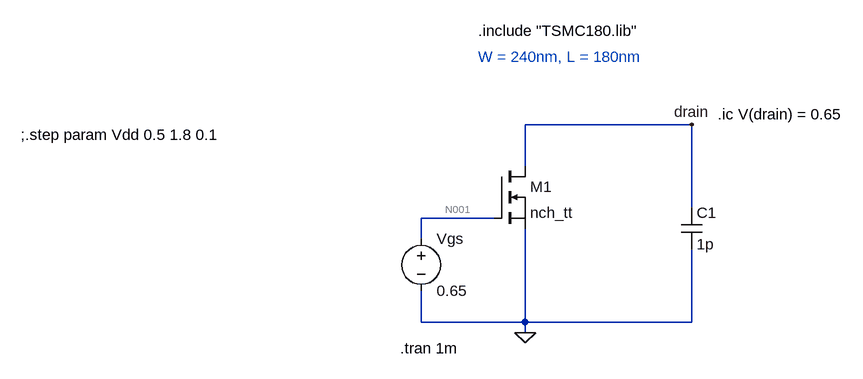
[diagram p0: schematic Q1_nmos_240_180.asc]
Q1_nmos_240_180.asc, the LTspice schematic file:
Version 4
SHEET 1 1284 680
WIRE 400 192 144 192
WIRE 144 256 144 192
WIRE 400 320 400 192
WIRE 96 336 -16 336
WIRE -16 368 -16 336
WIRE -16 496 -16 448
WIRE 144 496 144 352
WIRE 144 496 -16 496
WIRE 400 496 400 384
WIRE 400 496 144 496
WIRE 144 512 144 496
FLAG 144 512 0
FLAG 400 192 drain
SYMBOL nmos 96 256 R0
SYMATTR InstName M1
SYMATTR Value nch_tt
SYMATTR Value2 W=240n L=180n
SYMBOL voltage -16 352 R0
WINDOW 123 0 0 Left 0
WINDOW 39 0 0 Left 0
SYMATTR InstName Vgs
SYMATTR Value 0.65
SYMBOL cap 384 320 R0
SYMATTR InstName C1
SYMATTR Value 1p
TEXT 72 48 Left 2 !.include "TSMC180.lib"
TEXT 72 88 Left 2 ;W = 240nm, L = 180nm
TEXT 440 176 Left 2 !.ic V(drain) = 0.65
TEXT -48 536 Left 2 !.tran 1m
TEXT -632 208 Left 2 !;.step param Vdd 0.5 1.8 0.1

The netlist it stands for:
* Q1_nmos_240_180.asc
M1 drain N001 0 0 nch_tt W=240n L=180n
Vgs N001 0 0.65
C1 drain 0 1p
.model NMOS NMOS
.model PMOS PMOS
.lib standard.mos
.include "TSMC180.lib"
* W = 240nm, L = 180nm
.ic V(drain) = 0.65
.tran 1m
;.step param Vdd 0.5 1.8 0.1
.backanno
.end

* Results of the author's LTspice run, read from the files saved beside the schematic
* Operating Point, zero values left out:
*   V(drain) = 650 mV
*   V(n001) = 650 mV
*   Id(M1) = 10.07 µA
*   Is(M1) = -10.07 µA
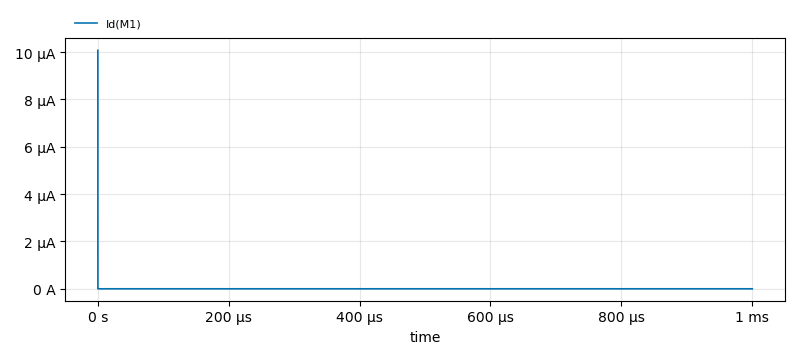
[diagram p1: Transient Analysis of Q1_nmos_240_180.asc, plotted from the saved traces]
* Transient Analysis, 1 run:
*   Id(M1): min -5.922 pA, max 10.07 µA, average 640.9 pA, rms 71.78 nA, last 0 A